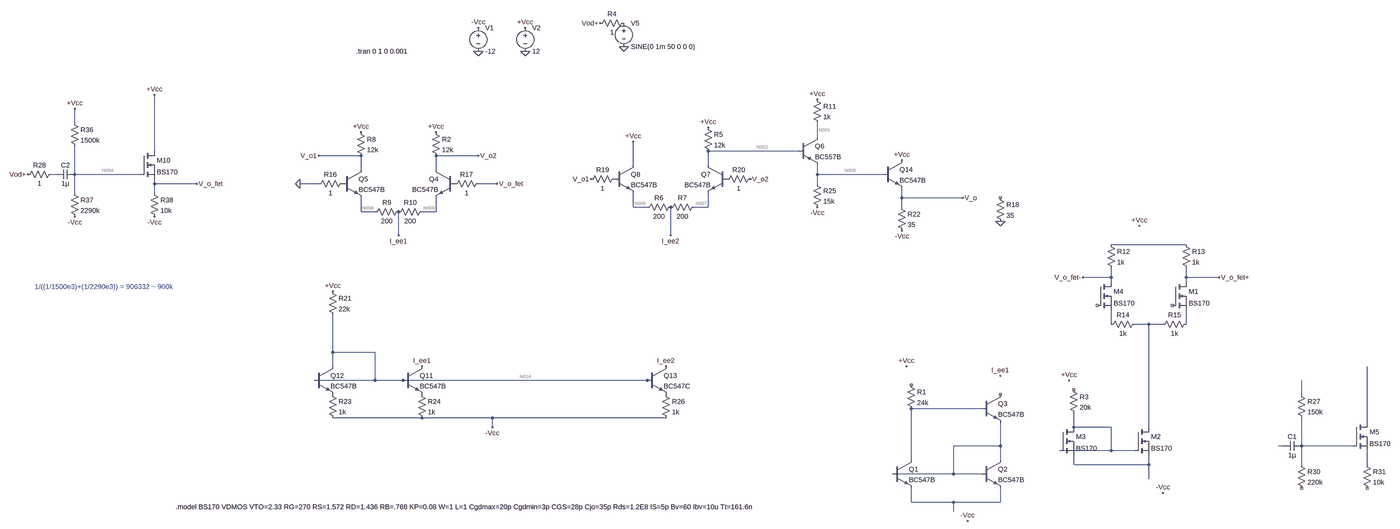
[diagram p0: schematic two_differential_amplifiers_at_the_same_time.asc, whole sheet]
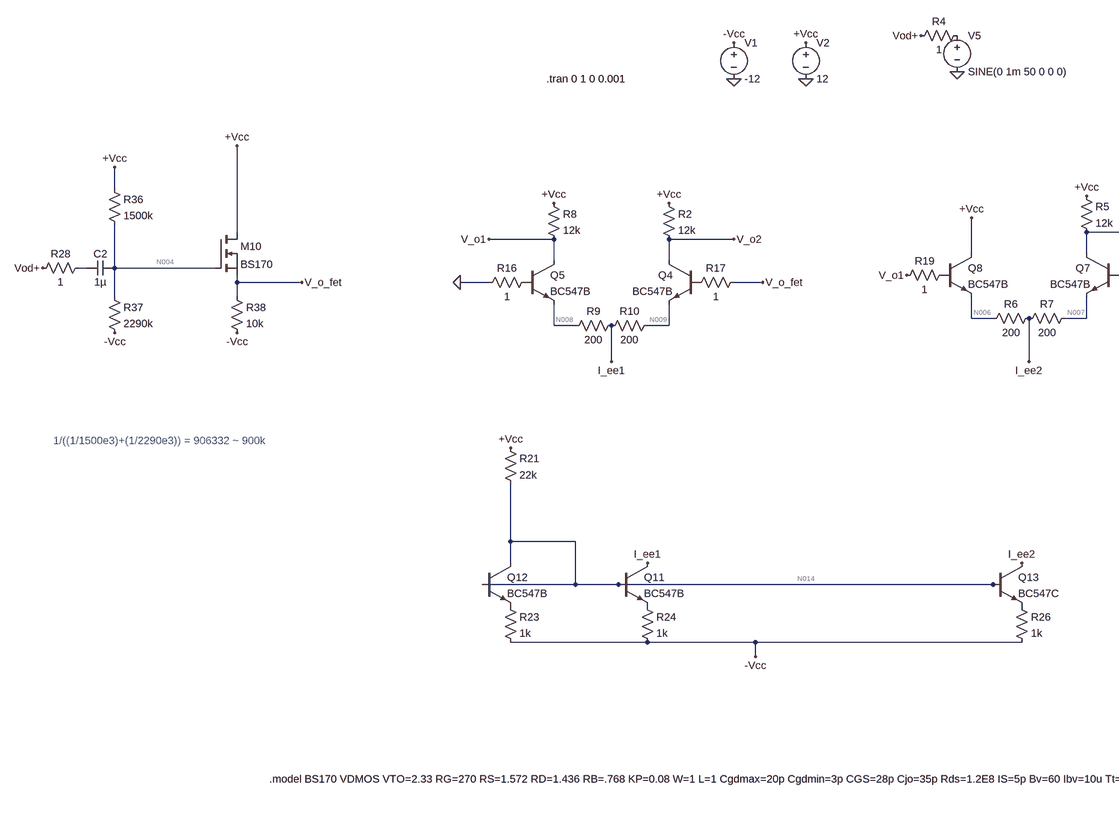
[diagram p1: schematic two_differential_amplifiers_at_the_same_time.asc, part, row 1 of 1, column 1 of 2]
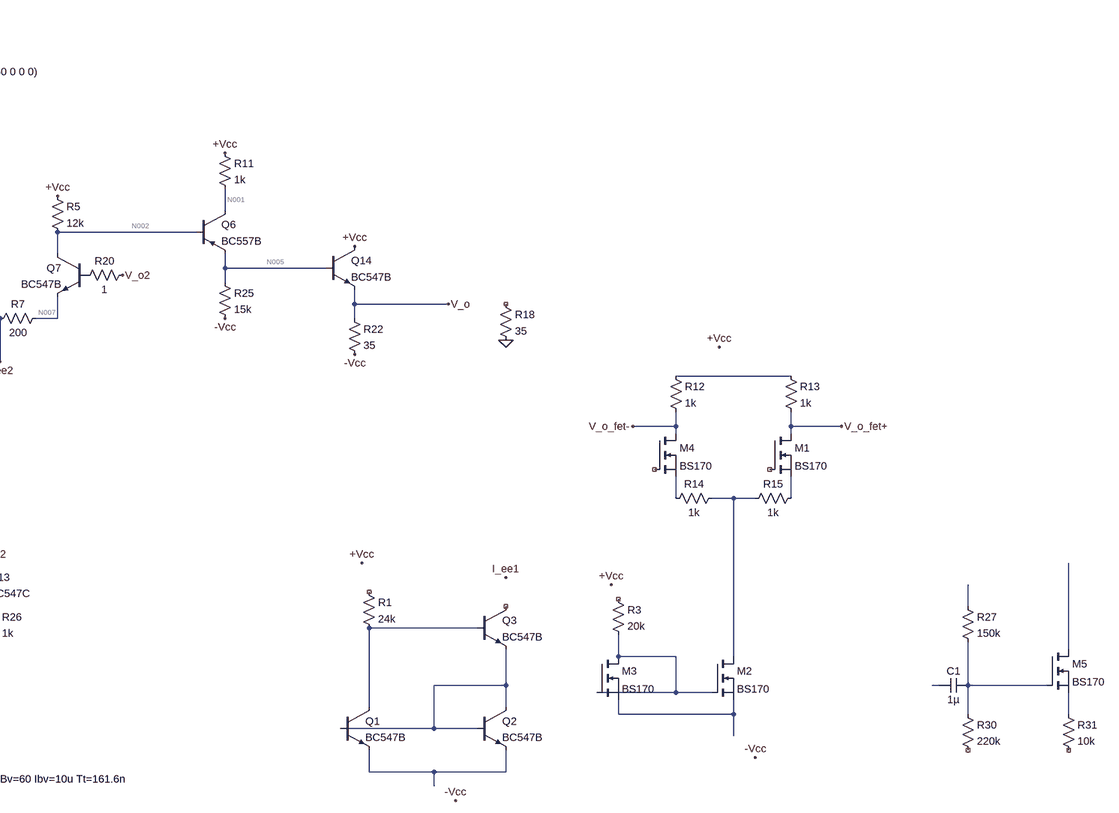
[diagram p2: schematic two_differential_amplifiers_at_the_same_time.asc, part, row 1 of 1, column 2 of 2]
two_differential_amplifiers_at_the_same_time.asc, the LTspice schematic file:
Version 4
SHEET 1 4084 732
WIRE -1440 -1104 -1440 -1152
WIRE 1152 -1056 1152 -1104
WIRE -1168 -1008 -1168 -1200
WIRE 1088 -1008 720 -1008
WIRE -464 -992 -608 -992
WIRE -64 -992 -208 -992
WIRE 464 -960 464 -1040
WIRE 720 -960 720 -1008
WIRE -464 -944 -464 -992
WIRE -208 -944 -208 -992
WIRE -1504 -928 -1520 -928
WIRE -1440 -928 -1440 -1024
WIRE -1216 -928 -1440 -928
WIRE 1152 -928 1152 -960
WIRE 1376 -928 1152 -928
WIRE -1168 -896 -1168 -912
WIRE -1024 -896 -1168 -896
WIRE -608 -896 -672 -896
WIRE 0 -896 -64 -896
WIRE 1152 -896 1152 -928
WIRE -1440 -864 -1440 -928
WIRE -1168 -864 -1168 -896
WIRE 1440 -848 1440 -880
WIRE 1648 -848 1440 -848
WIRE 464 -816 464 -864
WIRE 512 -816 464 -816
WIRE 720 -816 720 -864
WIRE 720 -816 672 -816
WIRE 1440 -816 1440 -848
WIRE -464 -800 -464 -848
WIRE -416 -800 -464 -800
WIRE -208 -800 -208 -848
WIRE -208 -800 -256 -800
WIRE -336 -720 -336 -800
WIRE 592 -720 592 -816
WIRE 3280 -688 3024 -688
WIRE 3024 -576 3024 -608
WIRE 3024 -576 2928 -576
WIRE 3280 -576 3280 -608
WIRE 3392 -576 3280 -576
WIRE 3024 -560 3024 -576
WIRE 3280 -560 3280 -576
WIRE 3024 -416 3024 -464
WIRE 3152 -416 3104 -416
WIRE 3200 -416 3152 -416
WIRE 3280 -416 3280 -464
WIRE -560 -320 -560 -448
WIRE -416 -320 -560 -320
WIRE -560 -272 -560 -320
WIRE -416 -224 -416 -320
WIRE -416 -224 -624 -224
WIRE -320 -224 -416 -224
WIRE 512 -224 -320 -224
WIRE 528 -224 512 -224
WIRE 3728 -176 3728 -224
WIRE 1712 -128 1472 -128
WIRE -256 -96 -560 -96
WIRE -16 -96 -256 -96
WIRE 576 -96 -16 -96
WIRE 4000 -80 4000 -272
WIRE -16 -64 -16 -96
WIRE 2896 -64 2896 -112
WIRE 3024 -64 2896 -64
WIRE 3152 -64 3152 -416
WIRE 1776 0 1776 -80
WIRE 1776 0 1616 0
WIRE 3664 0 3648 0
WIRE 3728 0 3728 -96
WIRE 3952 0 3728 0
WIRE 3024 16 3024 -64
WIRE 3024 16 2848 16
WIRE 3104 16 3024 16
WIRE 1472 48 1472 -128
WIRE 1776 48 1776 0
WIRE 2896 64 2896 32
WIRE 3152 64 3152 32
WIRE 3152 64 2896 64
WIRE 3728 64 3728 0
WIRE 4000 64 4000 16
WIRE 1616 96 1616 0
WIRE 1616 96 1408 96
WIRE 1712 96 1616 96
WIRE 3152 112 3152 64
WIRE 1472 192 1472 144
WIRE 1616 192 1472 192
WIRE 1776 192 1776 144
WIRE 1776 192 1616 192
WIRE 1616 224 1616 192
FLAG -64 -1392 0
FLAG 96 -1392 0
FLAG -64 -1472 -Vcc
FLAG 96 -1472 +Vcc
FLAG 432 -1408 0
FLAG 352 -1488 Vod+
FLAG 1664 256 -Vcc
FLAG 1456 -272 +Vcc
FLAG -464 -1072 +Vcc
FLAG -208 -1072 +Vcc
FLAG 464 -1040 +Vcc
FLAG 720 -1088 +Vcc
FLAG 2880 -224 +Vcc
FLAG 3120 -752 +Vcc
FLAG 2928 -576 V_o_fet-
FLAG 3392 -576 V_o_fet+
FLAG 3200 160 -Vcc
FLAG 0 -896 V_o_fet
FLAG -64 -992 V_o2
FLAG -608 -992 V_o1
FLAG -672 -896 0
FLAG -560 -528 +Vcc
FLAG -256 -272 I_ee1
FLAG 576 -272 I_ee2
FLAG 592 -720 I_ee2
FLAG -336 -720 I_ee1
FLAG 1440 -976 +Vcc
FLAG 1440 -736 -Vcc
FLAG 1648 -848 V_o
FLAG -16 -64 -Vcc
FLAG 1776 -240 I_ee1
FLAG 864 -912 V_o2
FLAG 320 -912 V_o1
FLAG 1152 -1184 +Vcc
FLAG 1152 -816 -Vcc
FLAG -1440 -1152 +Vcc
FLAG -1168 -1200 +Vcc
FLAG -1168 -784 -Vcc
FLAG -1440 -784 -Vcc
FLAG -1600 -928 Vod+
FLAG -1024 -896 V_o_fet
FLAG 1776 -768 0
SYMBOL npn 1712 48 R0
SYMATTR InstName Q2
SYMATTR Value BC547B
SYMBOL voltage -64 -1488 R0
WINDOW 123 0 0 Left 0
WINDOW 39 0 0 Left 0
SYMATTR InstName V1
SYMATTR Value -12
SYMBOL voltage 96 -1488 R0
WINDOW 123 0 0 Left 0
WINDOW 39 0 0 Left 0
SYMATTR InstName V2
SYMATTR Value 12
SYMBOL npn 1408 48 R0
SYMATTR InstName Q1
SYMATTR Value BC547B
SYMBOL npn 1712 -176 R0
SYMATTR InstName Q3
SYMATTR Value BC547B
SYMBOL res 1456 -224 R0
SYMATTR InstName R1
SYMATTR Value 24k
SYMBOL npn -144 -944 M0
SYMATTR InstName Q4
SYMATTR Value BC547B
SYMBOL npn -528 -944 R0
SYMATTR InstName Q5
SYMATTR Value BC547B
SYMBOL res -224 -1088 R0
SYMATTR InstName R2
SYMATTR Value 12k
SYMBOL voltage 432 -1504 R0
WINDOW 123 0 0 Left 0
WINDOW 39 0 0 Left 0
SYMATTR InstName V5
SYMATTR Value SINE(0 1m 50 0 0 0)
SYMBOL res 448 -1504 R90
WINDOW 0 0 56 VBottom 2
WINDOW 3 32 56 VTop 2
SYMATTR InstName R4
SYMATTR Value 1
SYMBOL res -320 -816 R90
WINDOW 0 0 56 VBottom 2
WINDOW 3 32 56 VTop 2
SYMATTR InstName R9
SYMATTR Value 200
SYMBOL res -240 -816 R90
WINDOW 0 0 56 VBottom 2
WINDOW 3 32 56 VTop 2
SYMATTR InstName R10
SYMATTR Value 200
SYMBOL npn 784 -960 M0
SYMATTR InstName Q7
SYMATTR Value BC547B
SYMBOL npn 400 -960 R0
SYMATTR InstName Q8
SYMATTR Value BC547B
SYMBOL res 704 -1104 R0
SYMATTR InstName R5
SYMATTR Value 12k
SYMBOL res 608 -832 R90
WINDOW 0 0 56 VBottom 2
WINDOW 3 32 56 VTop 2
SYMATTR InstName R6
SYMATTR Value 200
SYMBOL res 688 -832 R90
WINDOW 0 0 56 VBottom 2
WINDOW 3 32 56 VTop 2
SYMATTR InstName R7
SYMATTR Value 200
SYMBOL res -480 -1088 R0
SYMATTR InstName R8
SYMATTR Value 12k
SYMBOL nmos 3232 -560 R0
SYMATTR InstName M1
SYMATTR Value BS170
SYMBOL nmos 3104 -64 R0
SYMATTR InstName M2
SYMATTR Value BS170
SYMBOL nmos 2848 -64 R0
SYMATTR InstName M3
SYMATTR Value BS170
SYMBOL res 2880 -208 R0
SYMATTR InstName R3
SYMATTR Value 20k
SYMBOL nmos 2976 -560 R0
SYMATTR InstName M4
SYMATTR Value BS170
SYMBOL res 3008 -704 R0
SYMATTR InstName R12
SYMATTR Value 1k
SYMBOL res 3264 -704 R0
SYMATTR InstName R13
SYMATTR Value 1k
SYMBOL res 3120 -432 R90
WINDOW 0 0 56 VBottom 2
WINDOW 3 32 56 VTop 2
SYMATTR InstName R14
SYMATTR Value 1k
SYMBOL res 3296 -432 R90
WINDOW 0 0 56 VBottom 2
WINDOW 3 32 56 VTop 2
SYMATTR InstName R15
SYMATTR Value 1k
SYMBOL res -512 -912 R90
WINDOW 0 0 56 VBottom 2
WINDOW 3 32 56 VTop 2
SYMATTR InstName R16
SYMATTR Value 1
SYMBOL res -48 -912 R90
WINDOW 0 0 56 VBottom 2
WINDOW 3 32 56 VTop 2
SYMATTR InstName R17
SYMATTR Value 1
SYMBOL res 416 -928 R90
WINDOW 0 0 56 VBottom 2
WINDOW 3 32 56 VTop 2
SYMATTR InstName R19
SYMATTR Value 1
SYMBOL res 880 -928 R90
WINDOW 0 0 56 VBottom 2
WINDOW 3 32 56 VTop 2
SYMATTR InstName R20
SYMATTR Value 1
SYMBOL npn -320 -272 R0
SYMATTR InstName Q11
SYMATTR Value BC547B
SYMBOL npn -624 -272 R0
SYMATTR InstName Q12
SYMATTR Value BC547B
SYMBOL res -576 -544 R0
SYMATTR InstName R21
SYMATTR Value 22k
SYMBOL npn 512 -272 R0
SYMATTR InstName Q13
SYMATTR Value BC547C
SYMBOL npn 1376 -976 R0
SYMATTR InstName Q14
SYMATTR Value BC547B
SYMBOL res 1424 -832 R0
SYMATTR InstName R22
SYMATTR Value 35
SYMBOL res -576 -192 R0
SYMATTR InstName R23
SYMATTR Value 1k
SYMBOL res -272 -192 R0
SYMATTR InstName R24
SYMATTR Value 1k
SYMBOL res 560 -192 R0
SYMATTR InstName R26
SYMATTR Value 1k
SYMBOL pnp 1088 -1056 R0
SYMATTR InstName Q6
SYMATTR Value BC557B
SYMBOL res 1136 -1200 R0
SYMATTR InstName R11
SYMATTR Value 1k
SYMBOL res 1136 -912 R0
SYMATTR InstName R25
SYMATTR Value 15k
SYMBOL nmos 3952 -80 R0
SYMATTR InstName M5
SYMATTR Value BS170
SYMBOL res 3712 -192 R0
SYMATTR InstName R27
SYMATTR Value 150k
SYMBOL res 3712 48 R0
SYMATTR InstName R30
SYMATTR Value 220k
SYMBOL cap 3728 -16 R90
WINDOW 0 0 32 VBottom 2
WINDOW 3 32 32 VTop 2
SYMATTR InstName C1
SYMATTR Value 1µ
SYMBOL res 3984 48 R0
SYMATTR InstName R31
SYMATTR Value 10k
SYMBOL nmos -1216 -1008 R0
SYMATTR InstName M10
SYMATTR Value BS170
SYMBOL res -1456 -1120 R0
SYMATTR InstName R36
SYMATTR Value 1500k
SYMBOL res -1456 -880 R0
SYMATTR InstName R37
SYMATTR Value 2290k
SYMBOL cap -1440 -944 R90
WINDOW 0 0 32 VBottom 2
WINDOW 3 32 32 VTop 2
SYMATTR InstName C2
SYMATTR Value 1µ
SYMBOL res -1184 -880 R0
SYMATTR InstName R38
SYMATTR Value 10k
SYMBOL res 1760 -864 R0
SYMATTR InstName R18
SYMATTR Value 35
SYMBOL res -1504 -944 R90
WINDOW 0 0 56 VBottom 2
WINDOW 3 32 56 VTop 2
SYMATTR InstName R28
SYMATTR Value 1
TEXT -480 -1392 Left 2 !.tran 0 1 0 0.001
TEXT -1096 208 Left 2 !.model BS170 VDMOS VTO=2.33 RG=270 RS=1.572 RD=1.436 RB=.768 KP=0.08 W=1 L=1 Cgdmax=20p Cgdmin=3p CGS=28p Cjo=35p Rds=1.2E8 IS=5p Bv=60 Ibv=10u Tt=161.6n
TEXT -1576 -544 Left 2 ;1/((1/1500e3)+(1/2290e3)) = 906332 ~ 900k

The netlist it stands for:
* two_differential_amplifiers_at_the_same_time.asc
Q2 N019 N019 N024 0 BC547B
V1 -Vcc 0 -12
V2 +Vcc 0 12
Q1 N016 N019 N024 0 BC547B
Q3 NC_01 N016 N019 0 BC547B
R1 NC_02 N016 24k
Q4 V_o2 P001 N009 0 BC547B
Q5 V_o1 P002 N008 0 BC547B
R2 +Vcc V_o2 12k
V5 P003 0 SINE(0 1m 50 0 0 0)
R4 P003 Vod+ 1
R9 I_ee1 N008 200
R10 N009 I_ee1 200
Q7 N002 P004 N007 0 BC547B
Q8 +Vcc P005 N006 0 BC547B
R5 +Vcc N002 12k
R6 I_ee2 N006 200
R7 N007 I_ee2 200
R8 +Vcc V_o1 12k
M1 V_o_fet+ NC_03 N013 N013 BS170
M2 N012 N018 N022 N022 BS170
M3 N018 N018 N022 N022 BS170
R3 NC_04 N018 20k
M4 V_o_fet- NC_05 N011 N011 BS170
R12 N010 V_o_fet- 1k
R13 N010 V_o_fet+ 1k
R14 N012 N011 1k
R15 N013 N012 1k
R16 P002 0 1
R17 V_o_fet P001 1
R19 P005 V_o1 1
R20 V_o2 P004 1
Q11 I_ee1 N014 P006 0 BC547B
Q12 N014 N014 P007 0 BC547B
R21 +Vcc N014 22k
Q13 I_ee2 N014 P008 0 BC547C
Q14 +Vcc N005 V_o 0 BC547B
R22 V_o -Vcc 35
R23 P007 -Vcc 1k
R24 P006 -Vcc 1k
R26 P008 -Vcc 1k
Q6 N001 N002 N005 0 BC557B
R11 +Vcc N001 1k
R25 N005 -Vcc 15k
M5 N017 N021 N023 N023 BS170
R27 N015 N021 150k
R30 N021 NC_06 220k
C1 N021 N020 1µ
R31 N023 NC_07 10k
M10 +Vcc N004 V_o_fet V_o_fet BS170
R36 +Vcc N004 1500k
R37 N004 -Vcc 2290k
C2 N004 N003 1µ
R38 V_o_fet -Vcc 10k
R18 NC_08 0 35
R28 N003 Vod+ 1
.model NPN NPN
.model PNP PNP
.lib standard.bjt
.model NMOS NMOS
.model PMOS PMOS
.lib standard.mos
.tran 0 1 0 0.001
.model BS170 VDMOS VTO=2.33 RG=270 RS=1.572 RD=1.436 RB=.768 KP=0.08 W=1 L=1 Cgdmax=20p Cgdmin=3p CGS=28p Cjo=35p Rds=1.2E8 IS=5p Bv=60 Ibv=10u Tt=161.6n
* 1/((1/1500e3)+(1/2290e3)) = 906332 ~ 900k
.backanno
.end

* Results of the author's LTspice run, read from the files saved beside the schematic
* Operating Point, zero values left out:
*   V(-vcc) = -12 V
*   V(+vcc) = 12 V
*   V(v_o2) = 6.006 V
*   V(p001) = -3.856 mV
*   V(n009) = -621.8 mV
*   V(v_o1) = 5.851 V
*   V(p002) = -1.652 µV
*   V(n008) = -618.8 mV
*   V(i_ee1) = -721.4 mV
*   V(n002) = 6.863 V
*   V(p004) = 6.006 V
*   V(n007) = 5.373 V
*   V(p005) = 5.851 V
*   V(n006) = 5.255 V
*   V(i_ee2) = 5.21 V
*   V(v_o_fet) = -3.855 mV
*   V(n014) = -10.35 V
*   V(p006) = -10.99 V
*   V(p007) = -10.99 V
*   V(p008) = -10.97 V
*   V(n005) = 953.6 mV
*   V(v_o) = -26.25 mV
*   V(n001) = 7.525 V
*   V(n004) = 2.501 V
*   Ic(Q6) = 4.475 mA
*   Ib(Q6) = -380.5 µA
*   Ie(Q6) = -4.095 mA
*   Ic(Q13) = 1.033 mA
*   Ib(Q13) = 1.759 µA
*   Ie(Q13) = -1.034 mA
*   Ic(Q14) = 338.9 mA
*   Ib(Q14) = 3.231 mA
*   Ie(Q14) = -342.1 mA
*   Ic(Q12) = 1.007 mA
*   Ib(Q12) = 3.569 µA
*   Ie(Q12) = -1.011 mA
*   Ic(Q11) = 1.012 mA
*   Ib(Q11) = 3.097 µA
*   Ie(Q11) = -1.015 mA
*   Ic(Q8) = 220.4 µA
*   Ib(Q8) = 709.5 nA
*   Ie(Q8) = -221.2 µA
*   Ic(Q7) = 808.6 µA
*   Ib(Q7) = 2.822 µA
*   Ie(Q7) = -811.4 µA
*   Ic(Q5) = 511.7 µA
*   Ib(Q5) = 1.652 µA
*   Ie(Q5) = -513.3 µA
*   Ic(Q4) = 496.7 µA
*   Ib(Q4) = 1.6 µA
*   Ie(Q4) = -498.3 µA
*   Id(M10) = 1.201 mA
*   Is(M10) = -1.201 mA
*   I(R38) = 1.2 mA
*   I(R37) = 6.332 µA
*   I(R36) = 6.332 µA
*   I(R25) = 863.6 µA
*   I(R11) = 4.475 mA
*   I(R26) = 1.034 mA
*   I(R24) = 1.015 mA
*   I(R23) = 1.011 mA
*   I(R22) = 342.1 mA
*   I(R21) = 1.016 mA
*   I(R20) = 2.822 µA
*   I(R19) = -709.5 nA
*   I(R17) = 1.6 µA
*   I(R16) = -1.652 µA
*   I(R8) = 512.4 µA
*   I(R7) = 811.4 µA
*   I(R6) = -221.2 µA
*   I(R5) = 428.1 µA
*   I(R10) = 498.3 µA
*   I(R9) = -513.3 µA
*   I(R2) = 499.5 µA
*   I(V2) = -347.2 mA
*   I(V1) = 347.2 mA
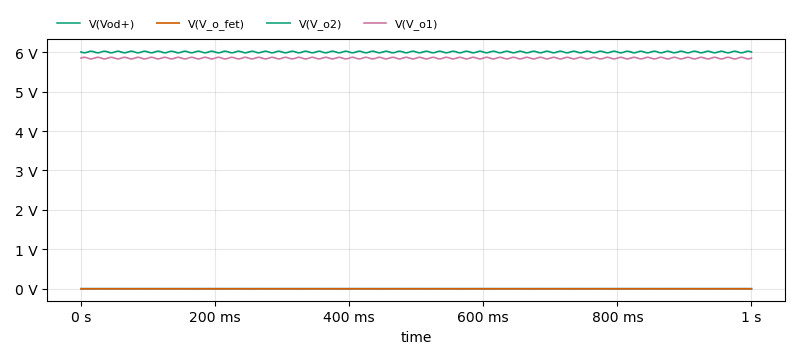
[diagram p3: Transient Analysis of two_differential_amplifiers_at_the_same_time.asc, plotted from the saved traces]
* Transient Analysis, 1 run:
*   V(Vod+): min -997.6 µV, max 997.6 µV, average -113.3 nV, rms 700.5 µV, last 0 V
*   V(V_o_fet): min -4.848 mV, max -2.866 mV, average -3.857 mV, rms 3.919 mV, last -3.852 mV
*   V(V_o2): min 5.986 V, max 6.026 V, average 6.006 V, rms 6.006 V, last 6.006 V
*   V(V_o1): min 5.831 V, max 5.871 V, average 5.851 V, rms 5.851 V, last 5.851 V